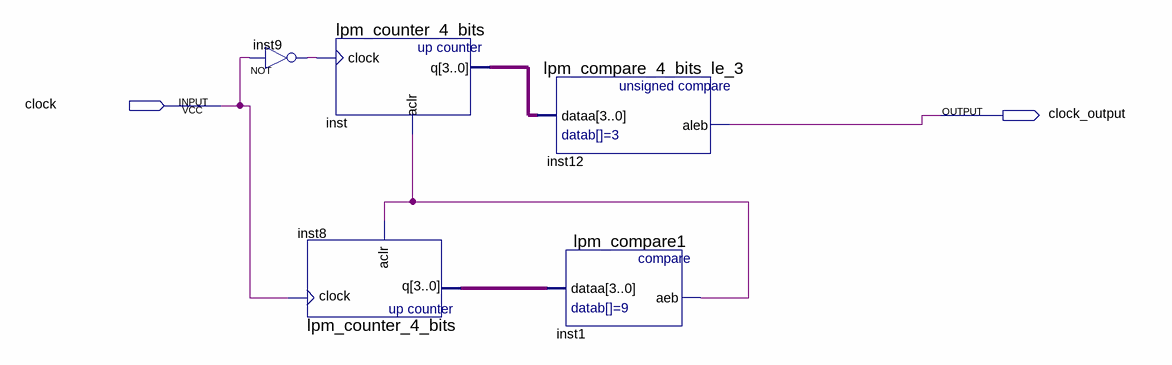
[diagram p0: schematic sheet]
// Quartus schematic BlockB.bdf as structural Verilog: 5 symbols, 2 pins
module BlockB (
  input  clock,
  output clock_output
);

  wire inst1_aeb, inst9_out;
  wire [3:0] inst8_q, inst_q;

  not inst9 (inst9_out, clock);
  lpm_counter_4_bits inst8 (.clock(clock), .aclr(inst1_aeb), .q(inst8_q));
  lpm_counter_4_bits inst (.clock(inst9_out), .aclr(inst1_aeb), .q(inst_q));
  lpm_compare_4_bits_le_3 inst12 (.dataa(inst_q), .aleb(clock_output));
  lpm_compare1 inst1 (.dataa(inst8_q), .aeb(inst1_aeb));
endmodule
